# Altium schematic sheet WIFI.SchDoc: WIFI
size A4
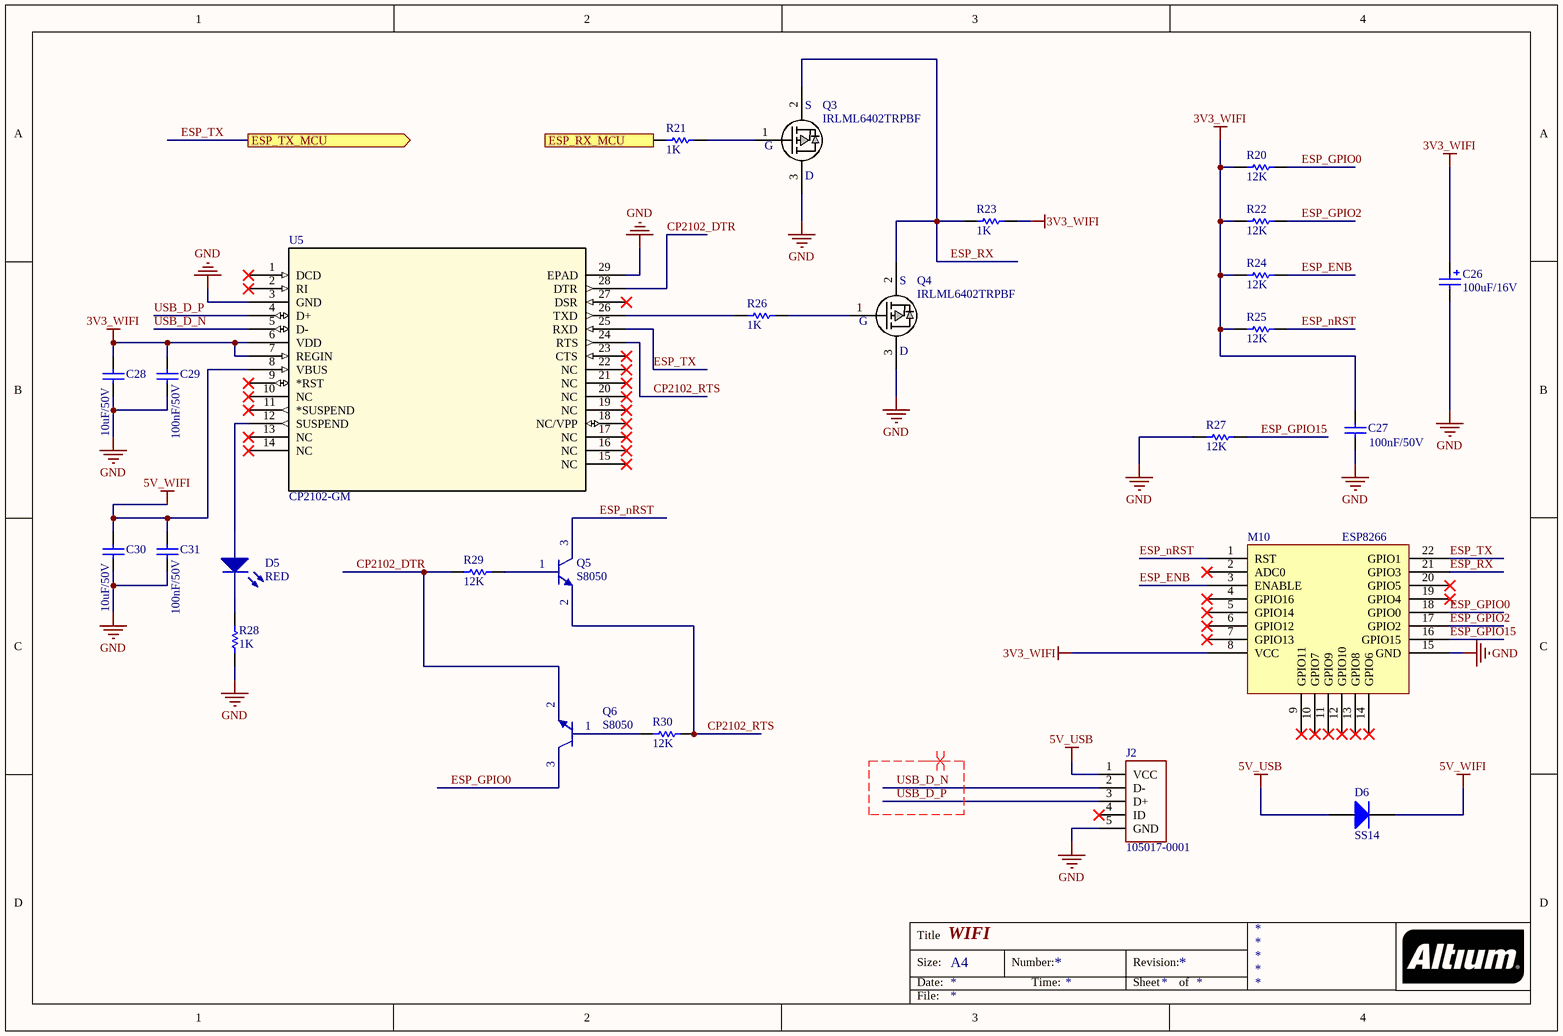
[diagram p0: WIFI.SchDoc]

## Parts
C26  value 100uF/16V  [CAP_SM_TAN]  (hidden comment: TAJB107M006RNJ)
C27  value 100nF/50V  [CAP-SM-0805]  (hidden comment: Cap-10uF-50V-0805)
C28  value 10uF/50V  [CAP-SM-0805]  (hidden comment: Cap-10uF-50V-0805)
C29  value 100nF/50V  [CAP-SM-0805]  (hidden comment: Cap-10uF-50V-0805)
C30  value 10uF/50V  [CAP-SM-0805]  (hidden comment: Cap-10uF-50V-0805)
C31  value 100nF/50V  [CAP-SM-0805]  (hidden comment: Cap-10uF-50V-0805)
D5  RED  [LED_0805_Blue]
D6  SS14  [SS14]
J2  105017-0001  [CONN_105017-0001]
M10  ESP8266  [ESP88]
Q3  IRLML6402TRPBF  [SOT23_NEX]
Q4  IRLML6402TRPBF  [SOT23_NEX]
Q5  S8050  [SOT23_NEX]
Q6  S8050  [SOT23_NEX]
R20  value 12K  [RES-SM-0805]  (hidden comment: Res-0-0805)
R21  value 1K  [RES-SM-0805]  (hidden comment: Res-0-0805)
R22  value 12K  [RES-SM-0805]  (hidden comment: Res-0-0805)
R23  value 1K  [RES-SM-0805]  (hidden comment: Res-0-0805)
R24  value 12K  [RES-SM-0805]  (hidden comment: Res-0-0805)
R25  value 12K  [RES-SM-0805]  (hidden comment: Res-0-0805)
R26  value 1K  [RES-SM-0805]  (hidden comment: Res-0-0805)
R27  value 12K  [RES-SM-0805]  (hidden comment: Res-0-0805)
R28  value 1K  [RES-SM-0805]  (hidden comment: Res-0-0805)
R29  value 12K  [RES-SM-0805]  (hidden comment: Res-0-0805)
R30  value 12K  [RES-SM-0805]  (hidden comment: Res-0-0805)
U5  CP2102-GM  [CP2102]

## Ports
ESP_RX_MCU (in), ESP_TX_MCU (out)

## Nets
3V3_WIFI: C26.1 C27.1 C28.1 C29.1 M10.8(VCC) R20.1 R22.1 R23.1 R24.1 R25.1 U5.6(VDD) U5.7(REGIN)
5V_USB: D6.2(A) J2.1(VCC)
5V_WIFI: C30.1 C31.1 D6.1(K) U5.8(VBUS)
GND: C26.2 C27.2 C28.2 C29.2 C30.2 C31.2 J2.5(GND) M10.15(GND) Q3.3(D) Q4.3(D) R27.1 R28.1 U5.3(GND) U5.29(EPAD)
CP2102_DTR: Q6.2(E) R29.1 U5.28(DTR)
CP2102_RTS: Q5.2(E) R30.2 U5.24(RTS)
ESP_ENB: M10.3(ENABLE) R24.2
ESP_GPIO0: M10.18(GPIO0) Q6.3(C) R20.2
ESP_GPIO2: M10.17(GPIO2) R22.2
ESP_GPIO15: M10.16(GPIO15) R27.2
ESP_nRST: M10.1(RST) Q5.3(C) R25.2
ESP_RX: M10.21(GPIO3) Q3.2(S) Q4.2(S) R23.2
ESP_RX_MCU: R21.1 ; port ESP_RX_MCU
ESP_TX: M10.22(GPIO1) U5.25(RXD) ; port ESP_TX_MCU
USB_D_N: J2.2(D-) U5.5(D-)
USB_D_P: J2.3(D+) U5.4(D+)
NetD5_1: D5.1(A) U5.12(SUSPEND)
NetD5_2: D5.2(K) R28.2
NetQ3_1: Q3.1(G) R21.2
NetQ4_1: Q4.1(G) R26.2
NetQ5_1: Q5.1(B) R29.2
NetQ6_1: Q6.1(B) R30.1
NetR26_1: R26.1 U5.26(TXD)

Not connected (* = marked no-connect by the designer): J2 4(ID)*; M10 2(ADC0)* 4(GPIO16)* 5(GPIO14)* 6(GPIO12)* 7(GPIO13)* 9(GPIO11)* 10(GPIO7)* 11(GPIO9)* 12(GPIO10)* 13(GPIO8)* 14(GPIO6)* 19(GPIO4)* 20(GPIO5)*; U5 1(DCD)* 2(RI)* 9(*RST)* 10(NC)* 11(*SUSPEND)* 13(NC)* 14(NC)* 15(NC)* 16(NC)* 17(NC)* 18(NC/VPP)* 19(NC)* 20(NC)* 21(NC)* 22(NC)* 23(CTS)* 27(DSR)*

## Layout directives
differential pair: USB_D_N, USB_D_P

## Notes on the sheet
- Title
- Size:
- Date:
- A4
- Number:
- Time:
- Revision:
- Sheet
- of
- File:

## Library data of the parts
C26 = Cap-Tan-100uF-16V: Manufacturer: Nichicon; Manufacturer Part Number: UWX1C101MCL1GB; Local Supplier: icdayroi; Local Supplier Link: https://icdayroi.com/tu-tantalum-100uf-16v-smd6032; Supplier 1: Digikey; Supplier 1 Part Number: 493-2105-1-ND; Supplier 1 Link: https://www.digikey.com/product-detail/en/nichicon/UWX1C101MCL1GB/493-2105-1-ND/590080
C27-C31 = Cap-10uF-50V-0805: CAP CER 10UF 50V X5R 0805; Manufacturer: Yageo; Manufacturer Part Number: CC0805KKX5R9BB106; Local Supplier: thegioiic; Local Supplier Link: https://thegioiic.com/products/tu-10uf-50v-0805; Supplier 1: Digikey; Supplier 1 Link: https://www.digikey.com/product-detail/en/yageo/CC0805KKX5R9BB106/311-3499-2-ND/7164383; Supplier 1 Part Number: 311-3499-2-ND
D5 = LED
D6 = Diode-SS14: DIODE SCHOTTKY 40V 1A SMA; Manufacturer: ON Semiconductor; Local Supplier: thegioiic; Local Supplier Link: https://thegioiic.com/products/ss14-sma; Supplier 1: Digikey; Supplier 1 Link: https://www.digikey.com/product-detail/en/on-semiconductor/SS14/SS14CT-ND/965729; Manufacturer Part Number: SS14; Supplier 1 Part Number: SS14CT-ND
J2 = 105017-0001: No Description Available; Vendor: Molex Connector Corporation; Built_By: EMA_Cory; SourceLibrary: Molex_2020-05-26; Datasheet: https://www.molex.com/pdm_docs/sd/1050170001_sd.pdf; Manufacturer_Part_Number: 105017-0001; Copyright: Copyright (C) 2018 Accelerated Designs. All rights reserved; RefDes: RefDes; Type: DEV
Q3 Q4 = IRLML6402TRPBF: P-Channel 20V 3.7A (Ta) 1.3W (Ta) Surface Mount Micro3™/SOT-23
R20-R30 = Res-0-0805: RES 0 OHM JUMPER 0805; Manufacturer: Vishay Dale; Manufacturer Part Number: WSL080500000ZEA9; Local Supplier: thegioiic; Local Supplier Link: https://thegioiic.com/products/dien-tro-0-ohm-0805-5; Supplier 1: Digikey; Supplier 1 Link: https://www.digikey.com/product-detail/en/vishay-dale/WSL080500000ZEA9/541-3928-1-ND/7423223; Supplier 1 Part Number: 541-3928-1-ND
U5 = CP2102-GM: No Description Available; Vendor: Silicon Labs; Built_By: EMA_UL_Team; SourceLibrary: Silicon_Labs_2015-03-23; Manufacturer_Part_Number: CP2102-GM; Copyright: Copyright (C) 2018 Accelerated Designs. All rights reserved; RefDes: RefDes; Type: DEV
M10 = ESP8266: Local supplier: Hshop; Local supplier link: https://hshop.vn/products/kit-rf-thu-phat-wifi-esp8266-nodemcu; Local supplier number: HS000592; manufacturer: *; Manufacturer Part Number: *